# EAGLE schematic schema_pm (EAGLE 9.6.2)
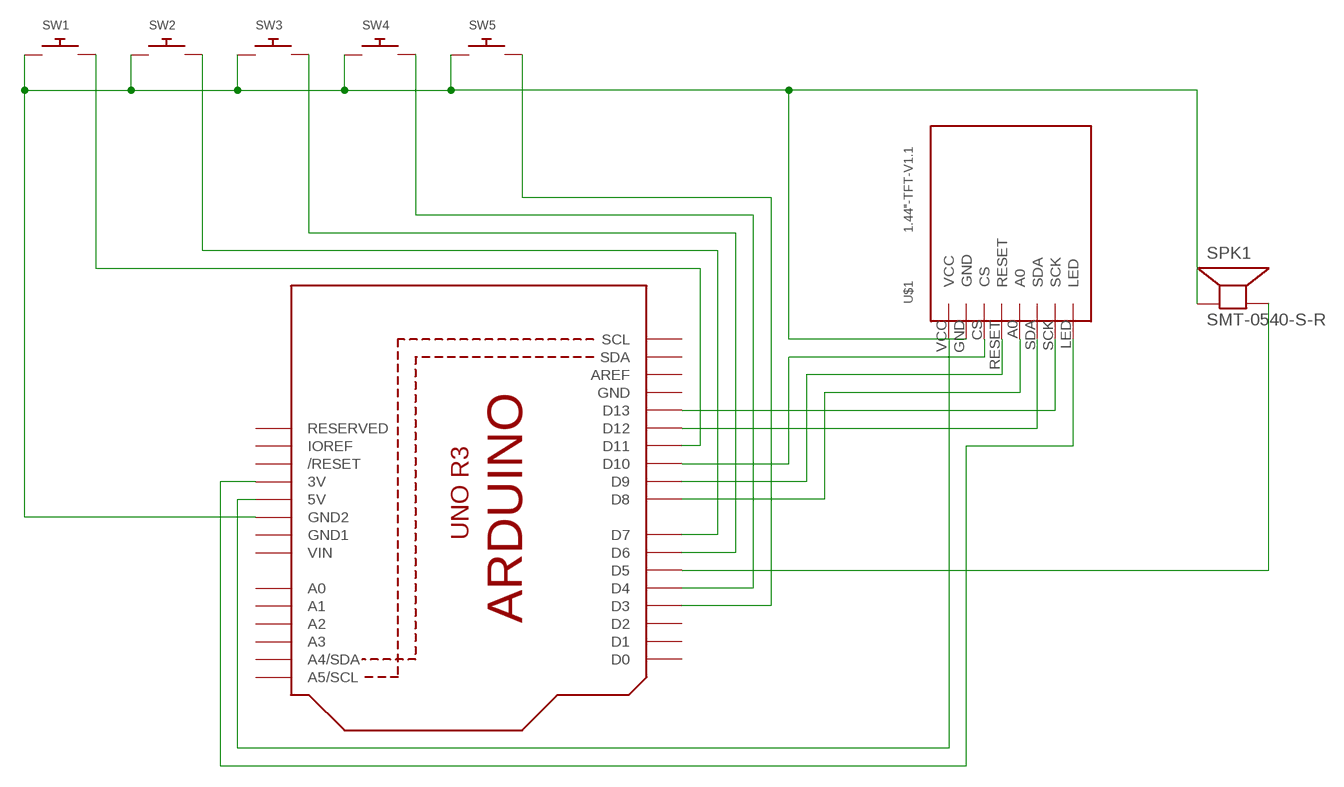
[diagram p0: schematic, sheet 1]

## Parts
SPK1  SMT-0540-S-R  [SMT-0540-S-R]
SW1  SWITCH_PUSHBUTTONC&K_KSS  [BTN_CK_KSS]
SW2  SWITCH_PUSHBUTTONC&K_KSS  [BTN_CK_KSS]
SW3  SWITCH_PUSHBUTTONC&K_KSS  [BTN_CK_KSS]
SW4  SWITCH_PUSHBUTTONC&K_KSS  [BTN_CK_KSS]
SW5  SWITCH_PUSHBUTTONC&K_KSS  [BTN_CK_KSS]
U1  ARDUINOR3-BPLACE  [ARDUINOR3-BPLACE]
U$1  1.44"-TFT-V1.1  [1.44-TFT-V1.1]

## Nets
N$1: SPK1.-(+) SW1.P$1 SW2.P$1 SW3.P$1 SW4.P$1 SW5.P$1 U1.GND2 U$1.GND
N$2: SW1.P$2 U1.D11
N$3: SW2.P$2 U1.D7
N$4: SW3.P$2 U1.D6
N$5: SW4.P$2 U1.D4
N$6: SW5.P$2 U1.D3
N$7: U1.5V U$1.VCC
N$8: U1.D9 U$1.RESET
N$9: U1.D10 U$1.CS
N$10: U1.D8 U$1.A0
N$11: U1.D12 U$1.SDA
N$12: U1.D13 U$1.SCK
N$13: U1.3V U$1.LED
N$14: SPK1.+(-) U1.D5
Unconnected: U1.A0 U1.A1 U1.A2 U1.A3 U1.A4(A4/SDA) U1.A5(A5/SCL) U1.AREF U1.D0 U1.D1 U1.D2 U1.IOREF U1.RESERVED U1.RESET(/RESET) U1.SCL U1.SDA

## Power pins joined to a net without a drawn wire
GND: U1.GND
GND1: U1.GND1
VIN: U1.VIN

## Library data of the parts
SPK1 = adafruit:SMT-0540-S-R: SMT-0549-S-R Small surface-mount magnetic buzzer
SW1-SW5 = adafruit:SWITCH_PUSHBUTTON: Buttons SOFTTOUCHSMD_SJ - Soft touch temporary push button (Super Junk Akihabara) Compatible with SKPMANE010 [Mouser: 688-SKPMAN] C&K_KSS = Digikey: KSS221GLFS
U1 = adafruit:ARDUINOR3: This is a new object for the new Arduino R3 - with extra pins that you may want to use (such as IOref, and duplicated A4/A5
U$1 = tft_1.8_1.44_oled_0.96:1.44"-TFT-V1.1